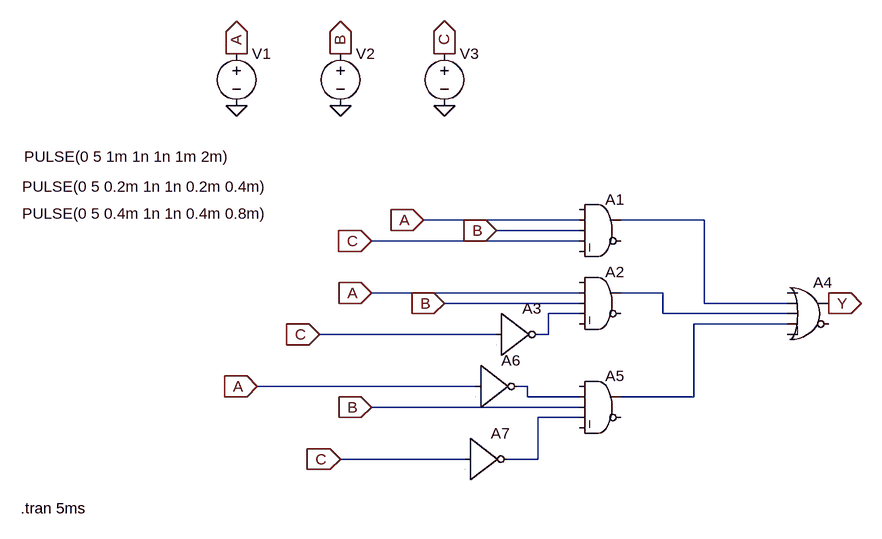
[diagram p0: schematic SOP.asc]
SOP.asc, the LTspice schematic file:
Version 4
SHEET 1 880 680
WIRE 128 80 -112 80
WIRE 320 80 192 80
WIRE 128 96 0 96
WIRE 128 112 -192 112
WIRE 128 192 -192 192
WIRE 256 192 192 192
WIRE 128 208 -80 208
WIRE 320 208 320 80
WIRE 448 208 320 208
WIRE 128 224 80 224
WIRE 256 224 256 192
WIRE 448 224 256 224
WIRE 448 240 304 240
WIRE 0 256 -272 256
WIRE 80 256 80 224
WIRE 80 256 64 256
WIRE -32 336 -368 336
WIRE 48 336 32 336
WIRE 48 352 48 336
WIRE 128 352 48 352
WIRE 304 352 304 240
WIRE 304 352 192 352
WIRE 128 368 -192 368
WIRE 128 384 64 384
WIRE -48 448 -240 448
WIRE 64 448 64 384
WIRE 64 448 16 448
FLAG -112 80 A
IOPIN -112 80 In
FLAG -192 192 A
IOPIN -192 192 In
FLAG -368 336 A
IOPIN -368 336 In
FLAG 0 96 B
IOPIN 0 96 In
FLAG -80 208 B
IOPIN -80 208 In
FLAG -192 368 B
IOPIN -192 368 In
FLAG -192 112 C
IOPIN -192 112 In
FLAG -272 256 C
IOPIN -272 256 In
FLAG -240 448 C
IOPIN -240 448 In
FLAG 512 208 Y
IOPIN 512 208 Out
FLAG -400 -96 0
FLAG -240 -96 0
FLAG -80 -96 0
FLAG -400 -176 A
IOPIN -400 -176 Out
FLAG -240 -176 B
IOPIN -240 -176 Out
FLAG -80 -176 C
IOPIN -80 -176 Out
SYMBOL Digital\\and 160 32 R0
SYMATTR InstName A1
SYMBOL Digital\\and 160 144 R0
SYMATTR InstName A2
SYMBOL Digital\\inv 0 192 R0
SYMATTR InstName A3
SYMBOL Digital\\or 480 160 R0
SYMATTR InstName A4
SYMBOL Digital\\and 160 304 R0
SYMATTR InstName A5
SYMBOL Digital\\inv -32 272 R0
SYMATTR InstName A6
SYMBOL Digital\\inv -48 384 R0
SYMATTR InstName A7
SYMBOL voltage -400 -192 R0
WINDOW 3 -327 174 Left 2
WINDOW 123 0 0 Left 0
WINDOW 39 0 0 Left 0
SYMATTR InstName V1
SYMATTR Value PULSE(0 5 1m 1n 1n 1m 2m)
SYMBOL voltage -240 -192 R0
WINDOW 3 -490 220 Left 2
WINDOW 123 0 0 Left 0
WINDOW 39 0 0 Left 0
SYMATTR InstName V2
SYMATTR Value PULSE(0 5 0.2m 1n 1n 0.2m 0.4m)
SYMBOL voltage -80 -192 R0
WINDOW 3 -650 262 Left 2
WINDOW 123 0 0 Left 0
WINDOW 39 0 0 Left 0
SYMATTR InstName V3
SYMATTR Value PULSE(0 5 0.4m 1n 1n 0.4m 0.8m)
TEXT -732 524 Left 2 !.tran 5ms

The netlist it stands for:
* SOP.asc
A1 0 A B C 0 0 N001 0 AND
A2 0 A B N003 0 0 N002 0 AND
A3 C 0 0 0 0 N003 0 0 BUF
A4 0 N001 N002 N004 0 0 Y 0 OR
A5 0 N005 B N006 0 0 N004 0 AND
A6 A 0 0 0 0 N005 0 0 BUF
A7 C 0 0 0 0 N006 0 0 BUF
V1 A 0 PULSE(0 5 1m 1n 1n 1m 2m)
V2 B 0 PULSE(0 5 0.2m 1n 1n 0.2m 0.4m)
V3 C 0 PULSE(0 5 0.4m 1n 1n 0.4m 0.8m)
.tran 5ms
.backanno
.end

* Results of the author's LTspice run, read from the files saved beside the schematic
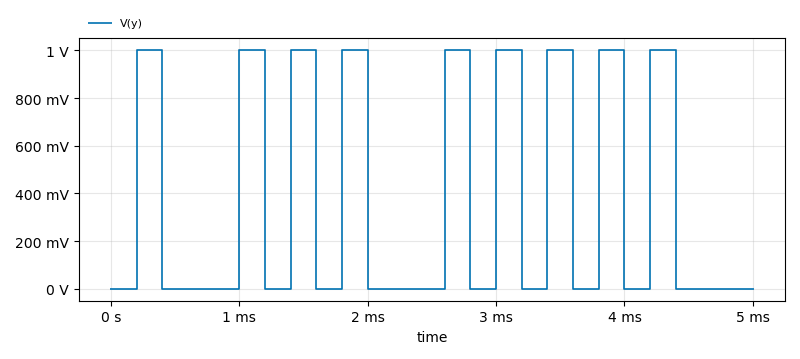
[diagram p1: Transient Analysis of SOP.asc, plotted from the saved traces]
* Transient Analysis, 1 run:
*   V(y): min 0 V, max 1 V, average 360 mV, rms 600 mV, last 0 V